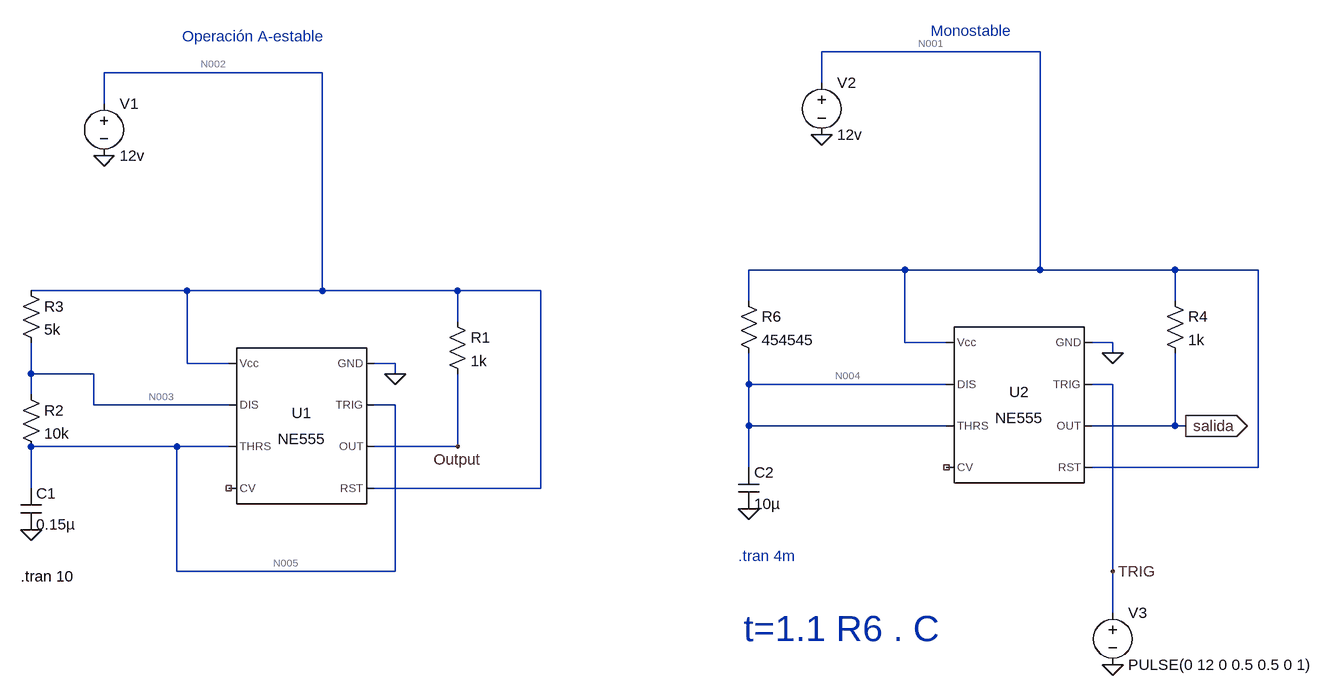
[diagram p0: schematic Draft1.asc]
Draft1.asc, the LTspice schematic file:
Version 4
SHEET 1 1880 680
WIRE 1408 -512 1072 -512
WIRE 304 -480 -32 -480
WIRE 1072 -464 1072 -512
WIRE -32 -432 -32 -480
WIRE 1200 -176 960 -176
WIRE 1408 -176 1408 -512
WIRE 1408 -176 1200 -176
WIRE 1616 -176 1408 -176
WIRE 1744 -176 1616 -176
WIRE 96 -144 -144 -144
WIRE 304 -144 304 -480
WIRE 304 -144 96 -144
WIRE 512 -144 304 -144
WIRE 640 -144 512 -144
WIRE 960 -128 960 -176
WIRE 1616 -128 1616 -176
WIRE 512 -96 512 -144
WIRE 1200 -64 1200 -176
WIRE 1264 -64 1200 -64
WIRE 1520 -64 1488 -64
WIRE 1520 -48 1520 -64
WIRE 96 -32 96 -144
WIRE 160 -32 96 -32
WIRE 416 -32 384 -32
WIRE -144 -16 -144 -64
WIRE -48 -16 -144 -16
WIRE 416 -16 416 -32
WIRE 960 0 960 -48
WIRE 1264 0 960 0
WIRE 1520 0 1488 0
WIRE -144 16 -144 -16
WIRE -48 32 -48 -16
WIRE 160 32 -48 32
WIRE 416 32 384 32
WIRE 960 64 960 0
WIRE 1264 64 960 64
WIRE 1616 64 1616 -48
WIRE 1616 64 1488 64
WIRE 1632 64 1616 64
WIRE 80 96 -144 96
WIRE 160 96 80 96
WIRE 512 96 512 -16
WIRE 512 96 384 96
WIRE 960 128 960 64
WIRE 1744 128 1744 -176
WIRE 1744 128 1488 128
WIRE -144 160 -144 96
WIRE 640 160 640 -144
WIRE 640 160 384 160
WIRE 80 288 80 96
WIRE 416 288 416 32
WIRE 416 288 80 288
WIRE 1520 288 1520 0
WIRE 1520 352 1520 288
FLAG 416 -16 0
FLAG -144 224 0
FLAG -32 -352 0
FLAG 1520 -48 0
FLAG 960 192 0
FLAG 1072 -384 0
FLAG 1520 432 0
FLAG 512 96 Output
FLAG 1632 64 salida
IOPIN 1632 64 Out
FLAG 1520 288 TRIG
SYMBOL Misc\\NE555 272 64 M0
SYMATTR InstName U1
SYMBOL res 496 -112 R0
SYMATTR InstName R1
SYMATTR Value 1k
SYMBOL res -160 0 R0
SYMATTR InstName R2
SYMATTR Value 10k
SYMBOL res -160 -160 R0
SYMATTR InstName R3
SYMATTR Value 5k
SYMBOL cap -160 160 R0
SYMATTR InstName C1
SYMATTR Value 0.15µ
SYMBOL voltage -32 -448 R0
WINDOW 123 0 0 Left 0
WINDOW 39 0 0 Left 0
SYMATTR InstName V1
SYMATTR Value 12v
SYMBOL Misc\\NE555 1376 32 M0
SYMATTR InstName U2
SYMBOL res 1600 -144 R0
SYMATTR InstName R4
SYMATTR Value 1k
SYMBOL res 944 -144 R0
SYMATTR InstName R6
SYMATTR Value 454545
SYMBOL cap 944 128 R0
SYMATTR InstName C2
SYMATTR Value 10µ
SYMBOL voltage 1072 -480 R0
WINDOW 123 0 0 Left 0
WINDOW 39 0 0 Left 0
SYMATTR InstName V2
SYMATTR Value 12v
SYMBOL voltage 1520 336 R0
WINDOW 123 0 0 Left 0
WINDOW 39 0 0 Left 0
SYMATTR InstName V3
SYMATTR Value PULSE(0 12 0 0.5 0.5 0 1)
TEXT -160 296 Left 2 !.tran 10
TEXT 944 264 Left 2 ;.tran 4m
TEXT 88 -536 Left 2 ;Operación A-estable
TEXT 1240 -544 Left 2 ;Monostable
TEXT 952 376 Left 5 ;t=1.1 R6 . C

The netlist it stands for:
* Draft1.asc
XU1 0 N005 Output N002 NC_01 N005 N003 N002 NE555  ; pins GND TRIG OUT RST CV THRS DIS Vcc
R1 N002 Output 1k
R2 N003 N005 10k
R3 N002 N003 5k
C1 N005 0 0.15µ
V1 N002 0 12v
XU2 0 TRIG salida N001 NC_02 N004 N004 N001 NE555  ; pins GND TRIG OUT RST CV THRS DIS Vcc
R4 N001 salida 1k
R6 N001 N004 454545
C2 N004 0 10µ
V2 N001 0 12v
V3 TRIG 0 PULSE(0 12 0 0.5 0.5 0 1)
.tran 10
* .tran 4m
* Operación A-estable
* Monostable
* t=1.1 R6 . C
.lib NE555.sub
.backanno
.end

* Results of the author's LTspice run, read from the files saved beside the schematic
* Operating Point, zero values left out:
*   V(output) = 12 V
*   V(n003) = 12 V
*   V(salida) = 12 V
*   V(n004) = 11.99 V
*   V(n005) = 12 V
*   V(n002) = 12 V
*   V(n001) = 12 V
*   I(R3) = 40.01 nA
*   I(R4) = 71.57 nA
*   I(R1) = 71.57 nA
*   I(V2) = -3.881 mA
*   I(R2) = 24 nA
*   I(V1) = -3.881 mA
*   I(R6) = 27.98 nA
*   Ix(u2:1) = -3.881 mA
*   Ix(u2:3) = 71.57 nA
*   Ix(u2:4) = 69.33 µA
*   Ix(u2:6) = 11.99 nA
*   Ix(u2:7) = 16 nA
*   Ix(u2:8) = 3.812 mA
*   Ix(u1:1) = -3.881 mA
*   Ix(u1:2) = 12 nA
*   Ix(u1:3) = 71.57 nA
*   Ix(u1:4) = 69.33 µA
*   Ix(u1:6) = 12 nA
*   Ix(u1:7) = 16.01 nA
*   Ix(u1:8) = 3.812 mA